# EAGLE schematic scrump (EAGLE 7.7.0)
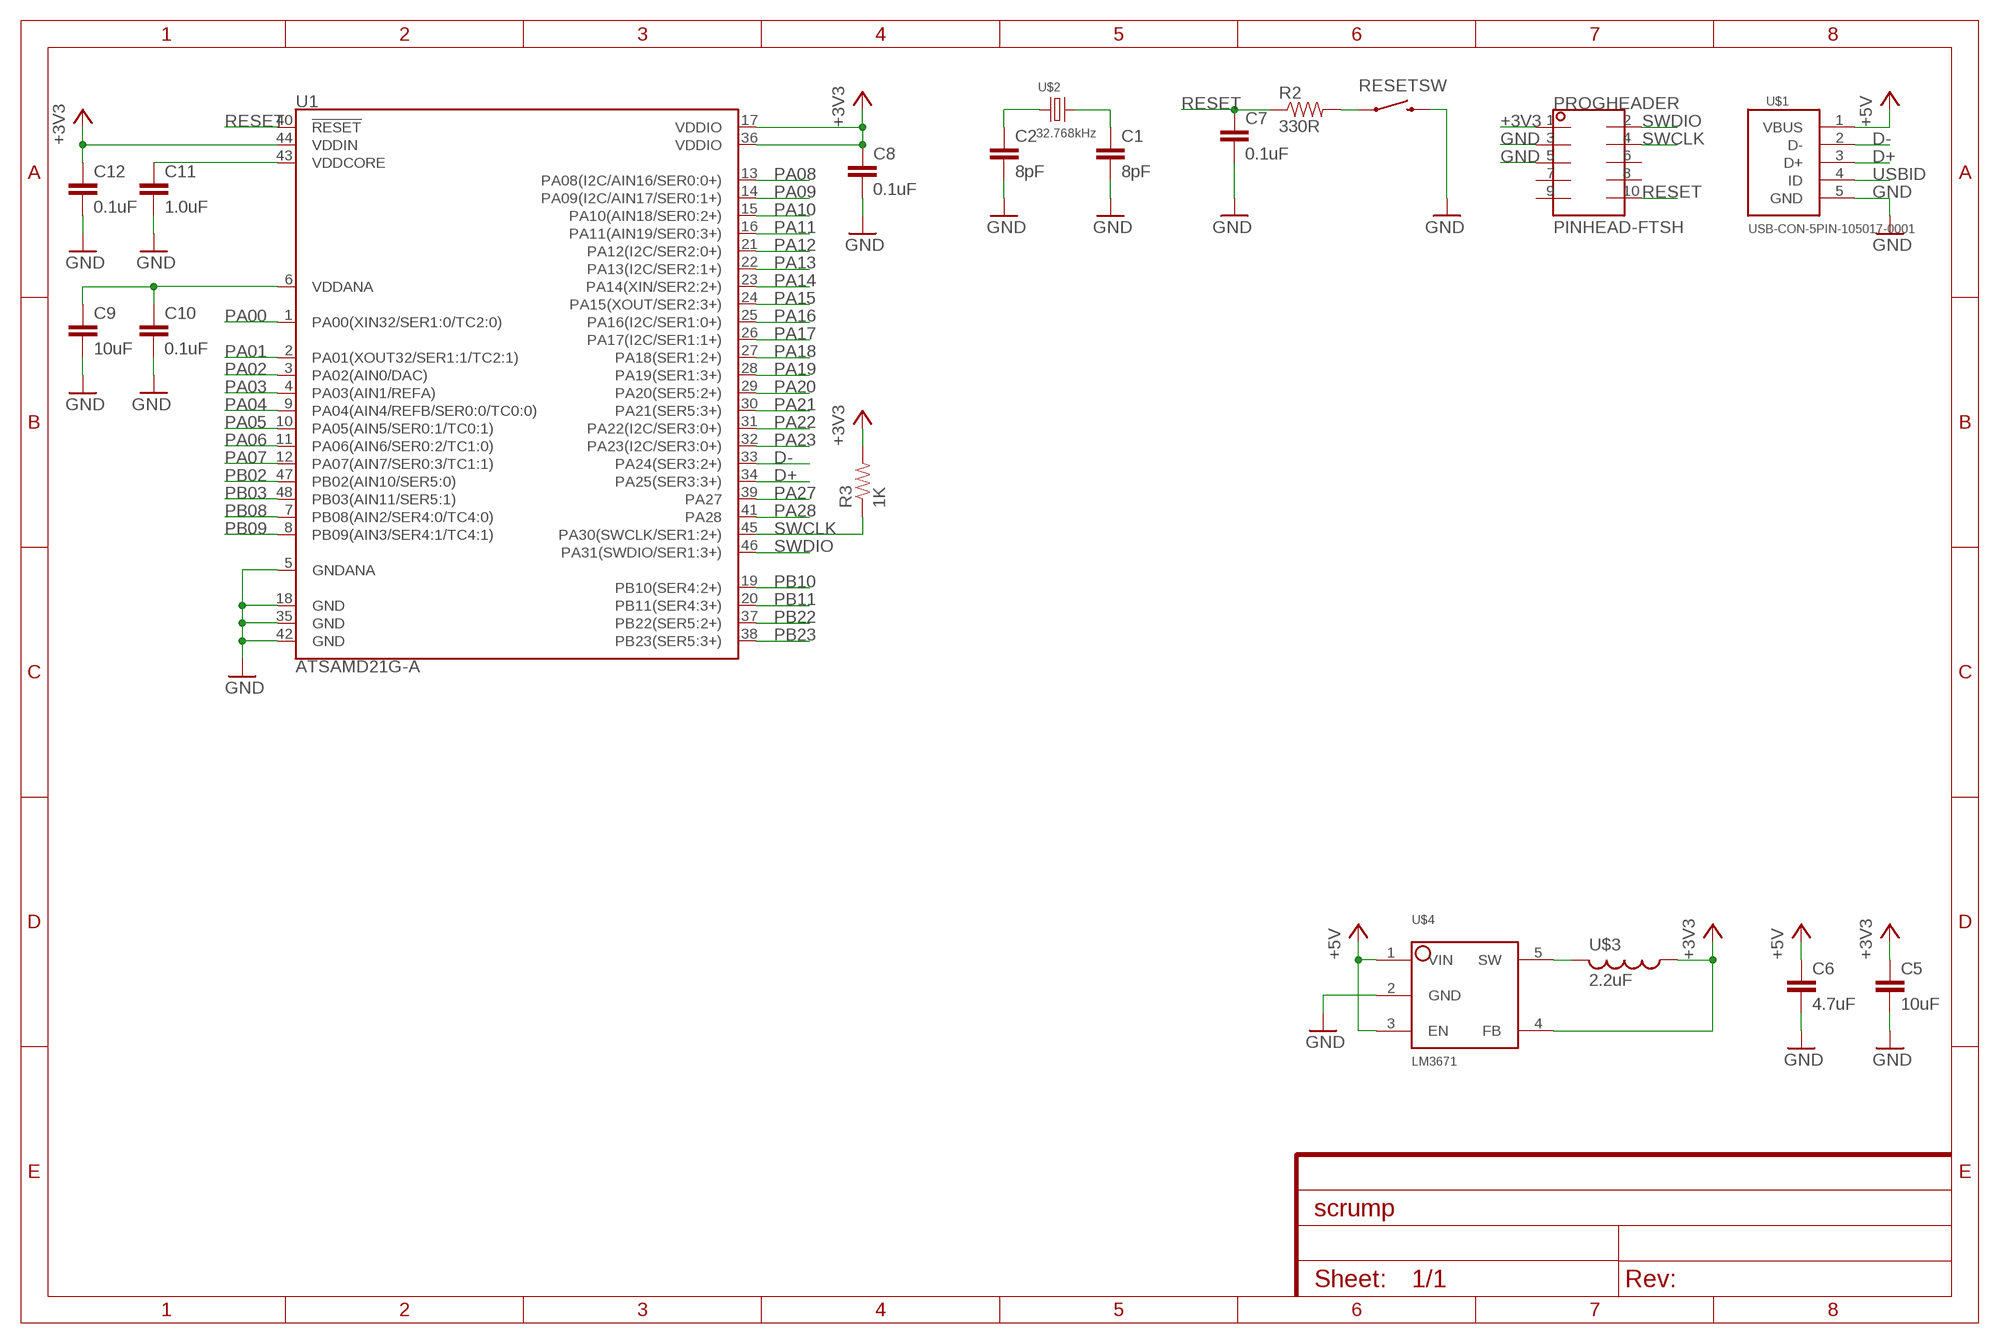
[diagram p0: schematic, sheet 1]

## Parts
C1  8pF  CAP0603-CAP  [0603-CAP]
C2  8pF  CAP0603-CAP  [0603-CAP]
C5  10uF  CAP0603-CAP  [0603-CAP]
C6  4.7uF  CAP0603-CAP  [0603-CAP]
C7  0.1uF  0.1UF-25V(+80/-20%)(0603)  [0603-CAP]
C8  0.1uF  CAP0603-CAP  [0603-CAP]
C9  10uF  CAP0603-CAP  [0603-CAP]
C10  0.1uF  CAP0603-CAP  [0603-CAP]
C11  1.0uF  CAP0603-CAP  [0603-CAP]
C12  0.1uF  CAP0603-CAP  [0603-CAP]
PROGHEADER  PINHEAD-FTSH  [FTSH-105-01-XXX-DV-K]
R2  330R  RESISTOR0603  [0603-RES]
R3  1K  RESISTOR0603  [0603-RES]
RESETSW  PUSHBUTTON-SMD  [TACTILE-SMD-SWITCH]
U1  ATSAMD21G-A  [TQFP-48]
U$1  USB-CON-5PIN-105017-0001  [USB-MICRO-MOLEX-105017-0001]
U$2  32.768kHz  CRYSTAL  [ABS25]
U$3  2.2uF  INDUCTOR  [0806-INDUCTOR]
U$4  LM3671  [SOT23-5]

## Nets
+3V3: C5.1 C8.1 C12.1 PROGHEADER.1 R3.2 U1.17(VDDIO) U1.36(VDDIO) U1.44(VDDIN) U$3.1 U$4.4(FB)
+5V: C6.1 U$1.1(VBUS) U$4.1(VIN) U$4.3(EN)
D+: U1.34(PA25(SER3:3+)) U$1.3(D+)
D-: U1.33(PA24(SER3:2+)) U$1.2(D-)
GND: C1.2 C2.2 C5.2 C6.2 C7.2 C8.2 C9.2 C10.2 C11.2 C12.2 PROGHEADER.3 PROGHEADER.5 RESETSW.P$3 RESETSW.P$4 U1.5(GNDANA) U1.18(GND) U1.35(GND) U1.42(GND) U$1.5(GND) U$4.2(GND)
N$1: C11.1 U1.43(VDDCORE)
N$2: R2.2 RESETSW.P$1 RESETSW.P$2
N$4: C9.1 C10.1 U1.6(VDDANA)
N$5: U$3.2 U$4.5(SW)
PA00: C2.1 U1.1(PA00(XIN32/SER1:0/TC2:0)) U$2.P$1
PA01: C1.1 U1.2(PA01(XOUT32/SER1:1/TC2:1)) U$2.P$4
PA02: U1.3(PA02(AIN0/DAC))
PA03: U1.4(PA03(AIN1/REFA))
PA04: U1.9(PA04(AIN4/REFB/SER0:0/TC0:0))
PA05: U1.10(PA05(AIN5/SER0:1/TC0:1))
PA06: U1.11(PA06(AIN6/SER0:2/TC1:0))
PA07: U1.12(PA07(AIN7/SER0:3/TC1:1))
PA08: U1.13(PA08(I2C/AIN16/SER0:0+))
PA09: U1.14(PA09(I2C/AIN17/SER0:1+))
PA10: U1.15(PA10(AIN18/SER0:2+))
PA11: U1.16(PA11(AIN19/SER0:3+))
PA12: U1.21(PA12(I2C/SER2:0+))
PA13: U1.22(PA13(I2C/SER2:1+))
PA14: U1.23(PA14(XIN/SER2:2+))
PA15: U1.24(PA15(XOUT/SER2:3+))
PA16: U1.25(PA16(I2C/SER1:0+))
PA17: U1.26(PA17(I2C/SER1:1+))
PA18: U1.27(PA18(SER1:2+))
PA19: U1.28(PA19(SER1:3+))
PA20: U1.29(PA20(SER5:2+))
PA21: U1.30(PA21(SER5:3+))
PA22: U1.31(PA22(I2C/SER3:0+))
PA23: U1.32(PA23(I2C/SER3:0+))
PA27: U1.39(PA27)
PA28: U1.41(PA28)
PB02: U1.47(PB02(AIN10/SER5:0))
PB03: U1.48(PB03(AIN11/SER5:1))
PB08: U1.7(PB08(AIN2/SER4:0/TC4:0))
PB09: U1.8(PB09(AIN3/SER4:1/TC4:1))
PB10: U1.19(PB10(SER4:2+))
PB11: U1.20(PB11(SER4:3+))
PB22: U1.37(PB22(SER5:2+))
PB23: U1.38(PB23(SER5:3+))
RESET: C7.1 PROGHEADER.10 R2.1 U1.40(!RESET!)
SWCLK: PROGHEADER.4 R3.1 U1.45(PA30(SWCLK/SER1:2+))
SWDIO: PROGHEADER.2 U1.46(PA31(SWDIO/SER1:3+))
USBID: U$1.4(ID)
Unconnected: PROGHEADER.6 PROGHEADER.7 PROGHEADER.8 PROGHEADER.9

## Library data of the parts
C1 C2 C5 C6 C8-C12 = SparkFun-Capacitors:CAP: Capacitor Standard 0603 ceramic capacitor, and 0.1" leaded capacitor.
C7 = SparkFun-Capacitors:0.1UF-25V(+80/-20%)(0603): CAP-00810 Ceramic Standard decoupling cap; PROD_ID: CAP-00810
PROGHEADER = mylibrary:PINHEAD-FTSH
R2 R3 = SparkFun-Resistors:RESISTOR: Resistor Basic schematic elements and footprints for 0603, 1206, and PTH resistors.
RESETSW = mylibrary:PUSHBUTTON-SMD
U1 = SparkFun-DigitalIC:ATSAMD21G: Atmel SAMD21G SMART ARM-Based Microcontroller The Atmel ® | SMART ™ SAM D21 is a series of low-power microcontrollers using the 32-bit ARM ® Cortex ® -M0+ processor, and ranging from 32- to 64-pins with up to 256KB Flash and 32KB of SRAM. The SAM D21 devices operate at a maximum frequency of 48MHz and reach 2.46 CoreMark/MHz. They are designed for simple and intuitive migration with identical peripheral modules, hex compatible code, identical linear address map and pin compatible migration paths between all devices in the product series. All devices include intelligent and flexible peripherals, Atmel Event System for inter-peripheral signaling, and support for capacitive touch button, slider and wheel user interfaces.; PROD_ID: IC-13064
U$1 = GeekAmmo:USB-CON-5PIN: Molex Micro USB 105017-0001
U$2 = mylibrary:CRYSTAL
U$3 = mylibrary:INDUCTOR
U$4 = mylibrary:LM3671